# EAGLE design flange_alone (EAGLE 7.2.0)
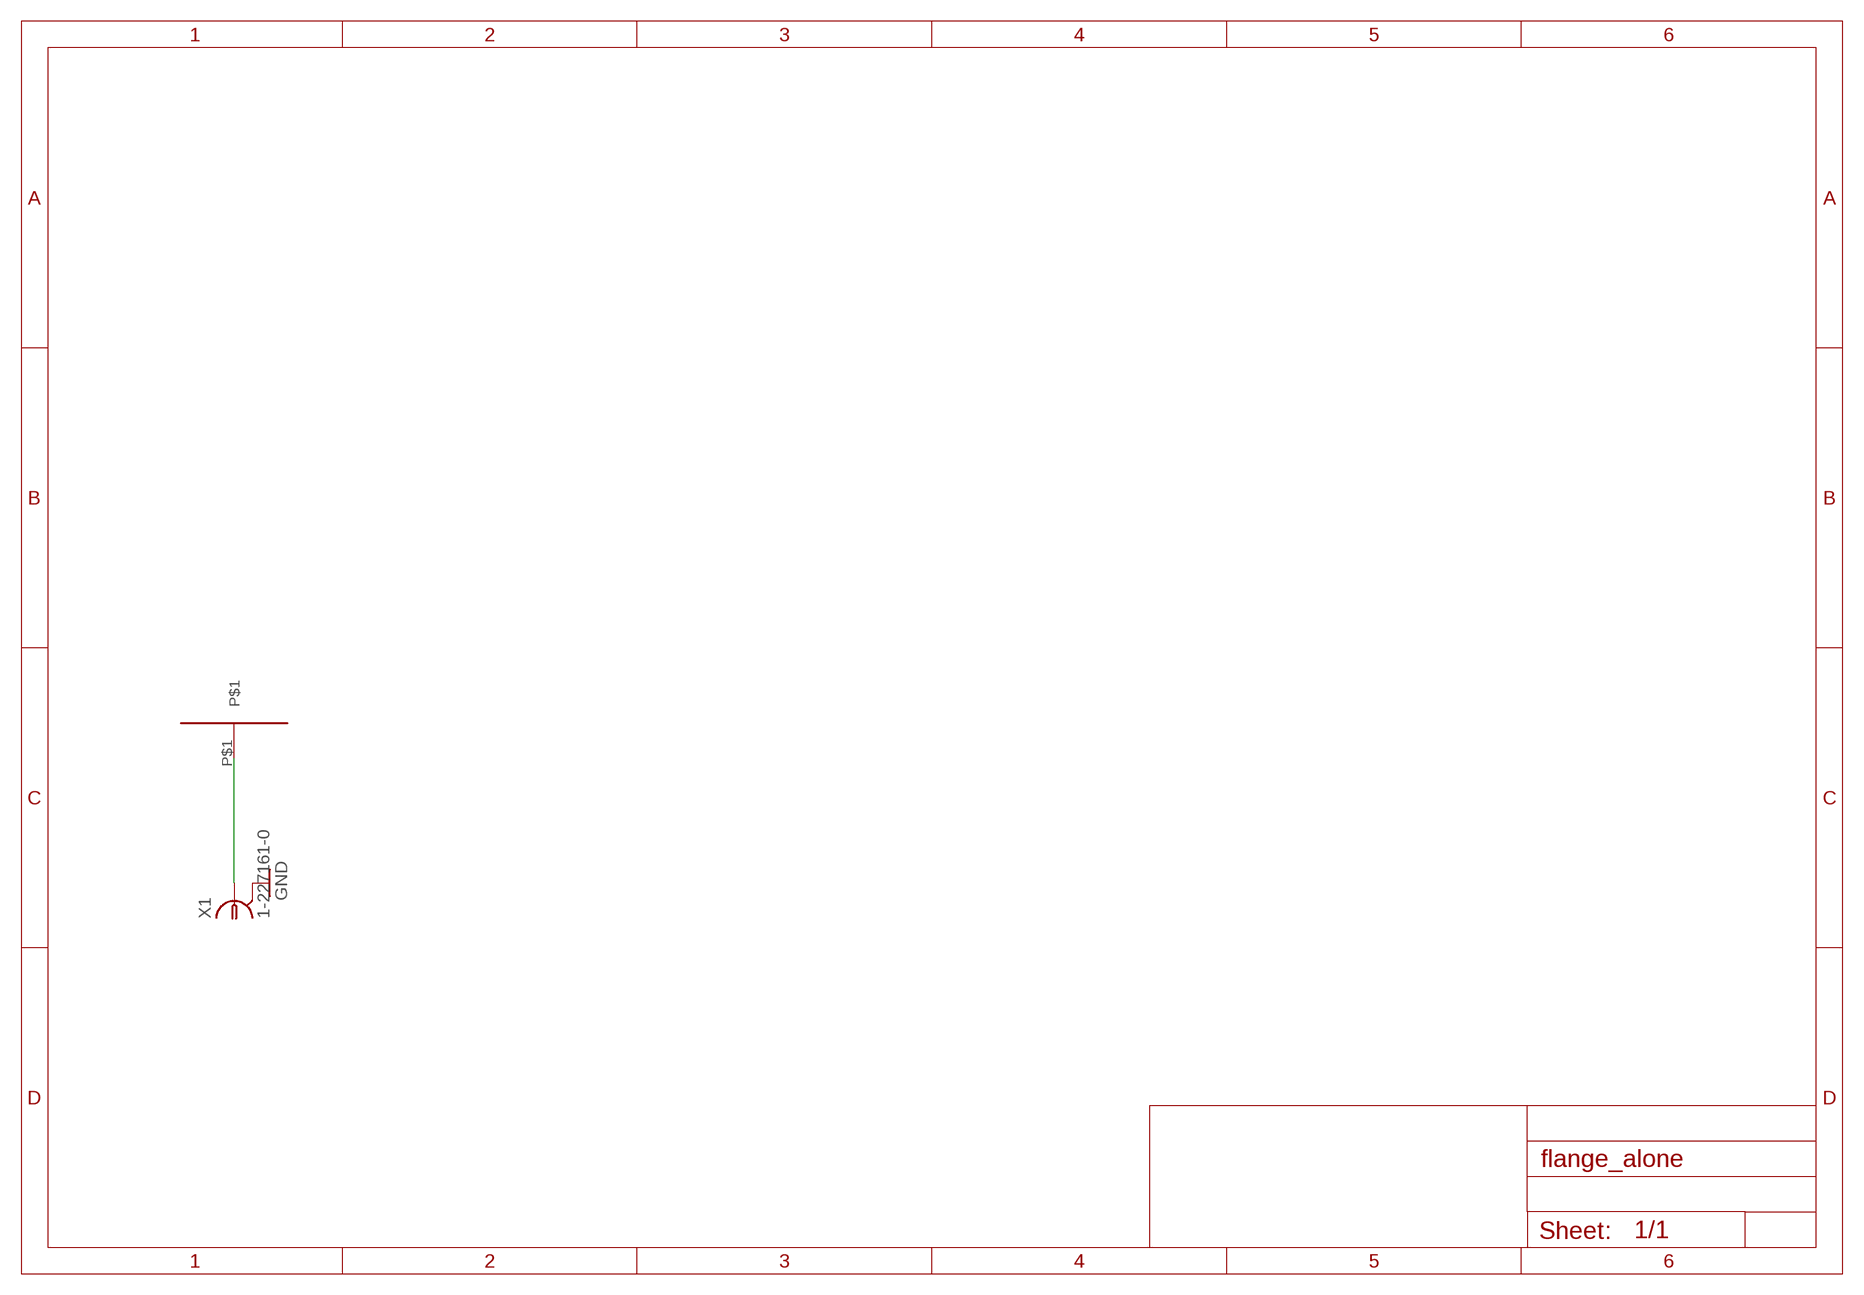
[diagram p0: schematic, sheet 1]

## Parts
U$1  CTIA  [CTIA]
X1  1-227161-0  [AMP_227161]

## Nets
GND: X1.2
N$1: U$1.P$1 X1.1

## Library data of the parts
U$1 = ctia:CTIA
X1 = con-coax:?227161*: JACK, RIGHT ANGLE, 50 OHM, PCB, BNC Source: amp_227161.pdf; MF: TYCO ELECTRONICS; MPN: 1-227161; OC_FARNELL: unknown; OC_NEWARK: 33B3200

## Board
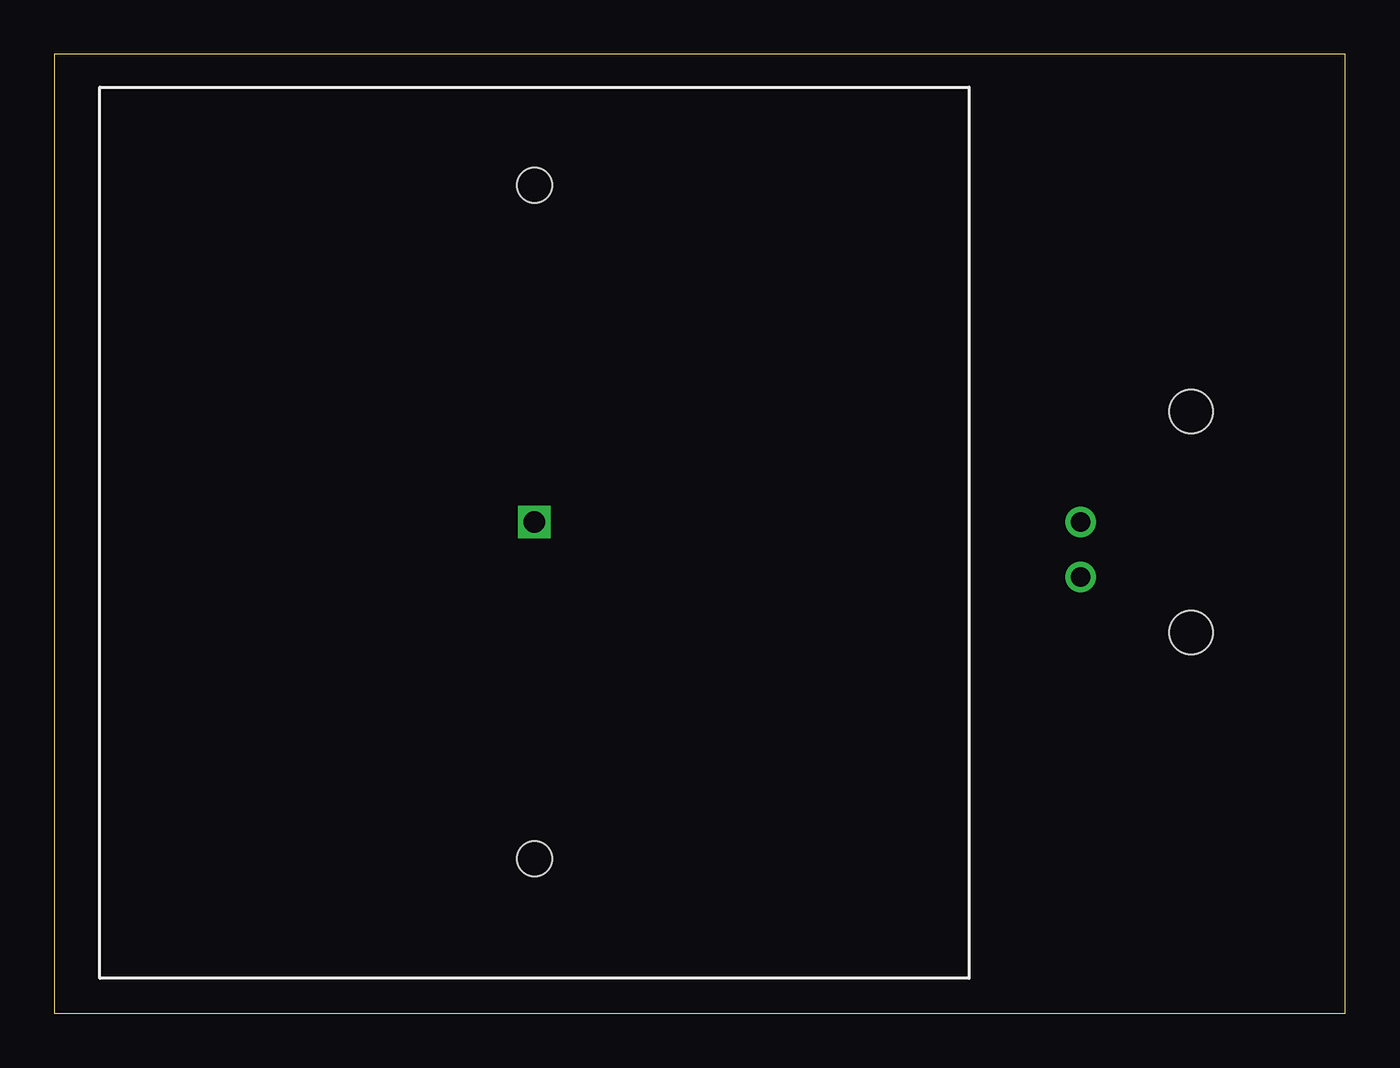
[diagram p1: board, top side]
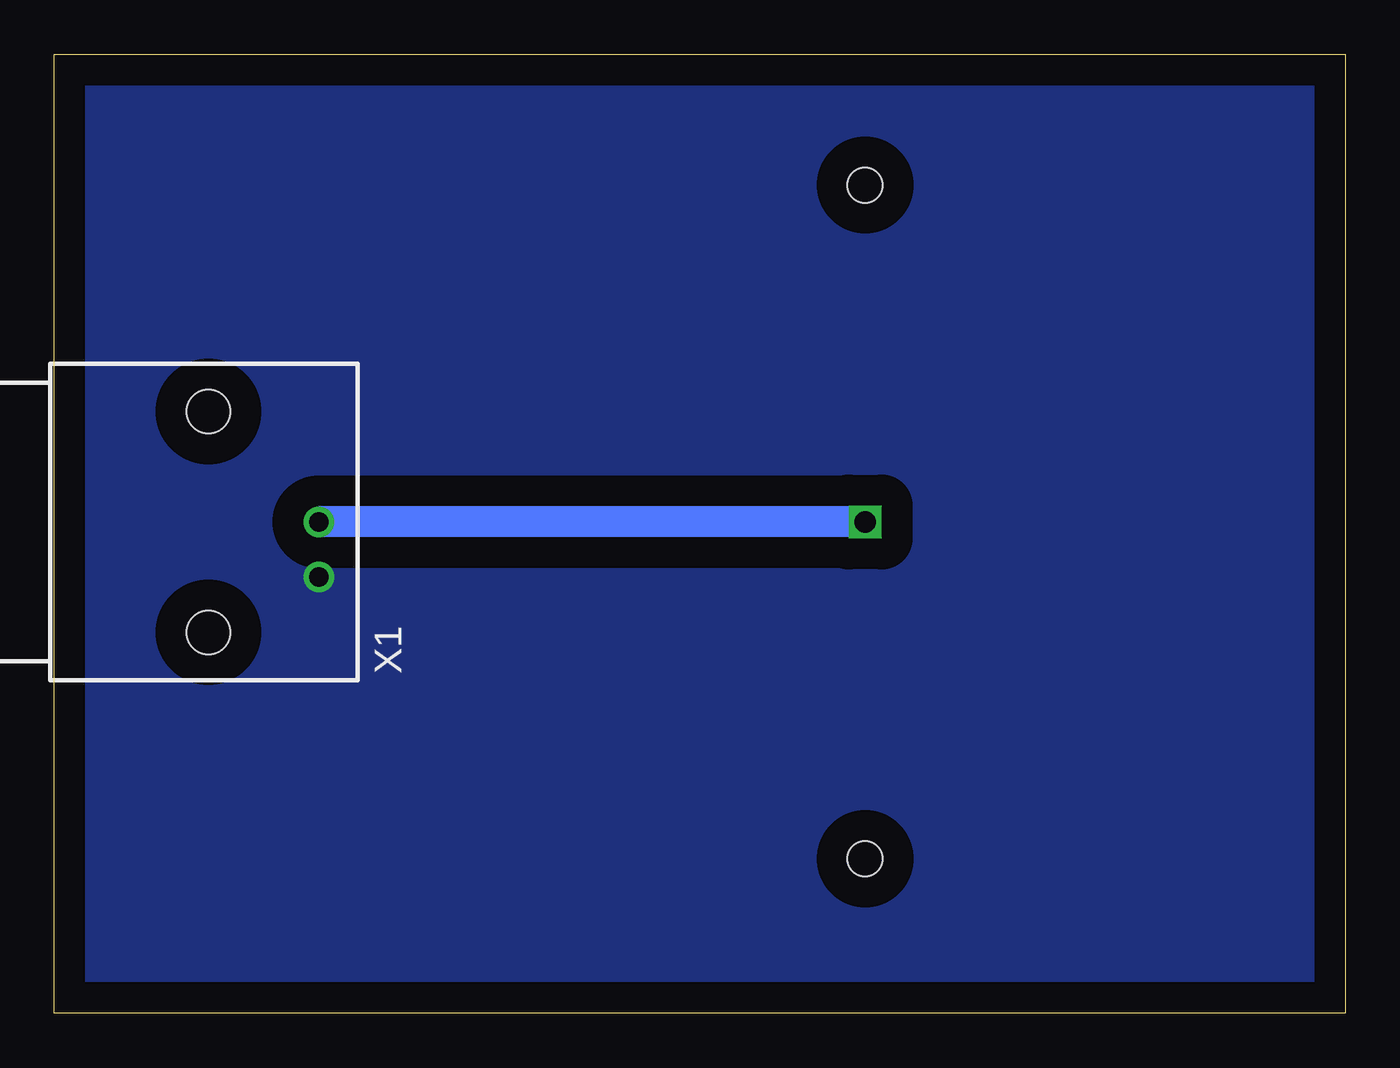
[diagram p2: board, bottom side, seen from below]

Size 59.42 x 44.12 mm. Coordinates in mm from the lower left corner, seen from the top.
Outline: 0,0 59.42,0 59.42,44.12 0,44.12 0,0
Copper layers (1*16): Top 0.035mm / dielectric 1.5mm / Bottom 0.035mm
Design rules "default": minimum track width 10mil, minimum drill 24mil, track to track 8mil, track to pad 8mil, pad to pad 8mil, via to via 8mil, smd to smd 8mil, copper to edge 40mil, drill to drill 8mil, minimum pad ring 10mil, minimum via ring 8mil, stop-mask expansion 4mil, vias tented up to drill 0mil, thermal gap 10mil
Holes 1 mm at 67.82,26.42 67.82,18.8

### Footprints (pad centres in the part's own frame; a part is rotated, then mirrored left to right if it is on the bottom)
CTIA = drill 1 square: P$1 0,0 | hole 1.6: 15.5,0; -15.5,0
AMP_227161 = drill 0.9 pad 1.27: 1 0,-5.08; 2 -2.54,-5.08 | hole 2: -5.08,0; 5.08,0

### Placement (x,y rotation side)
U$1  22.1,22.61 90 top
X1  52.32,22.61 90 bottom

### Tracks (layer width: path | path; a pad name or v marks a point on that pad's centre or on a via)
GND
  pour Bottom (isolate 1.422, no thermals): 0,44.45 59.44,44.45 59.44,0 0,0
N$1
  Bottom 1.422: U$1.P$1 X1.1